# EAGLE design avr_programming_shield_built (EAGLE 6.3)
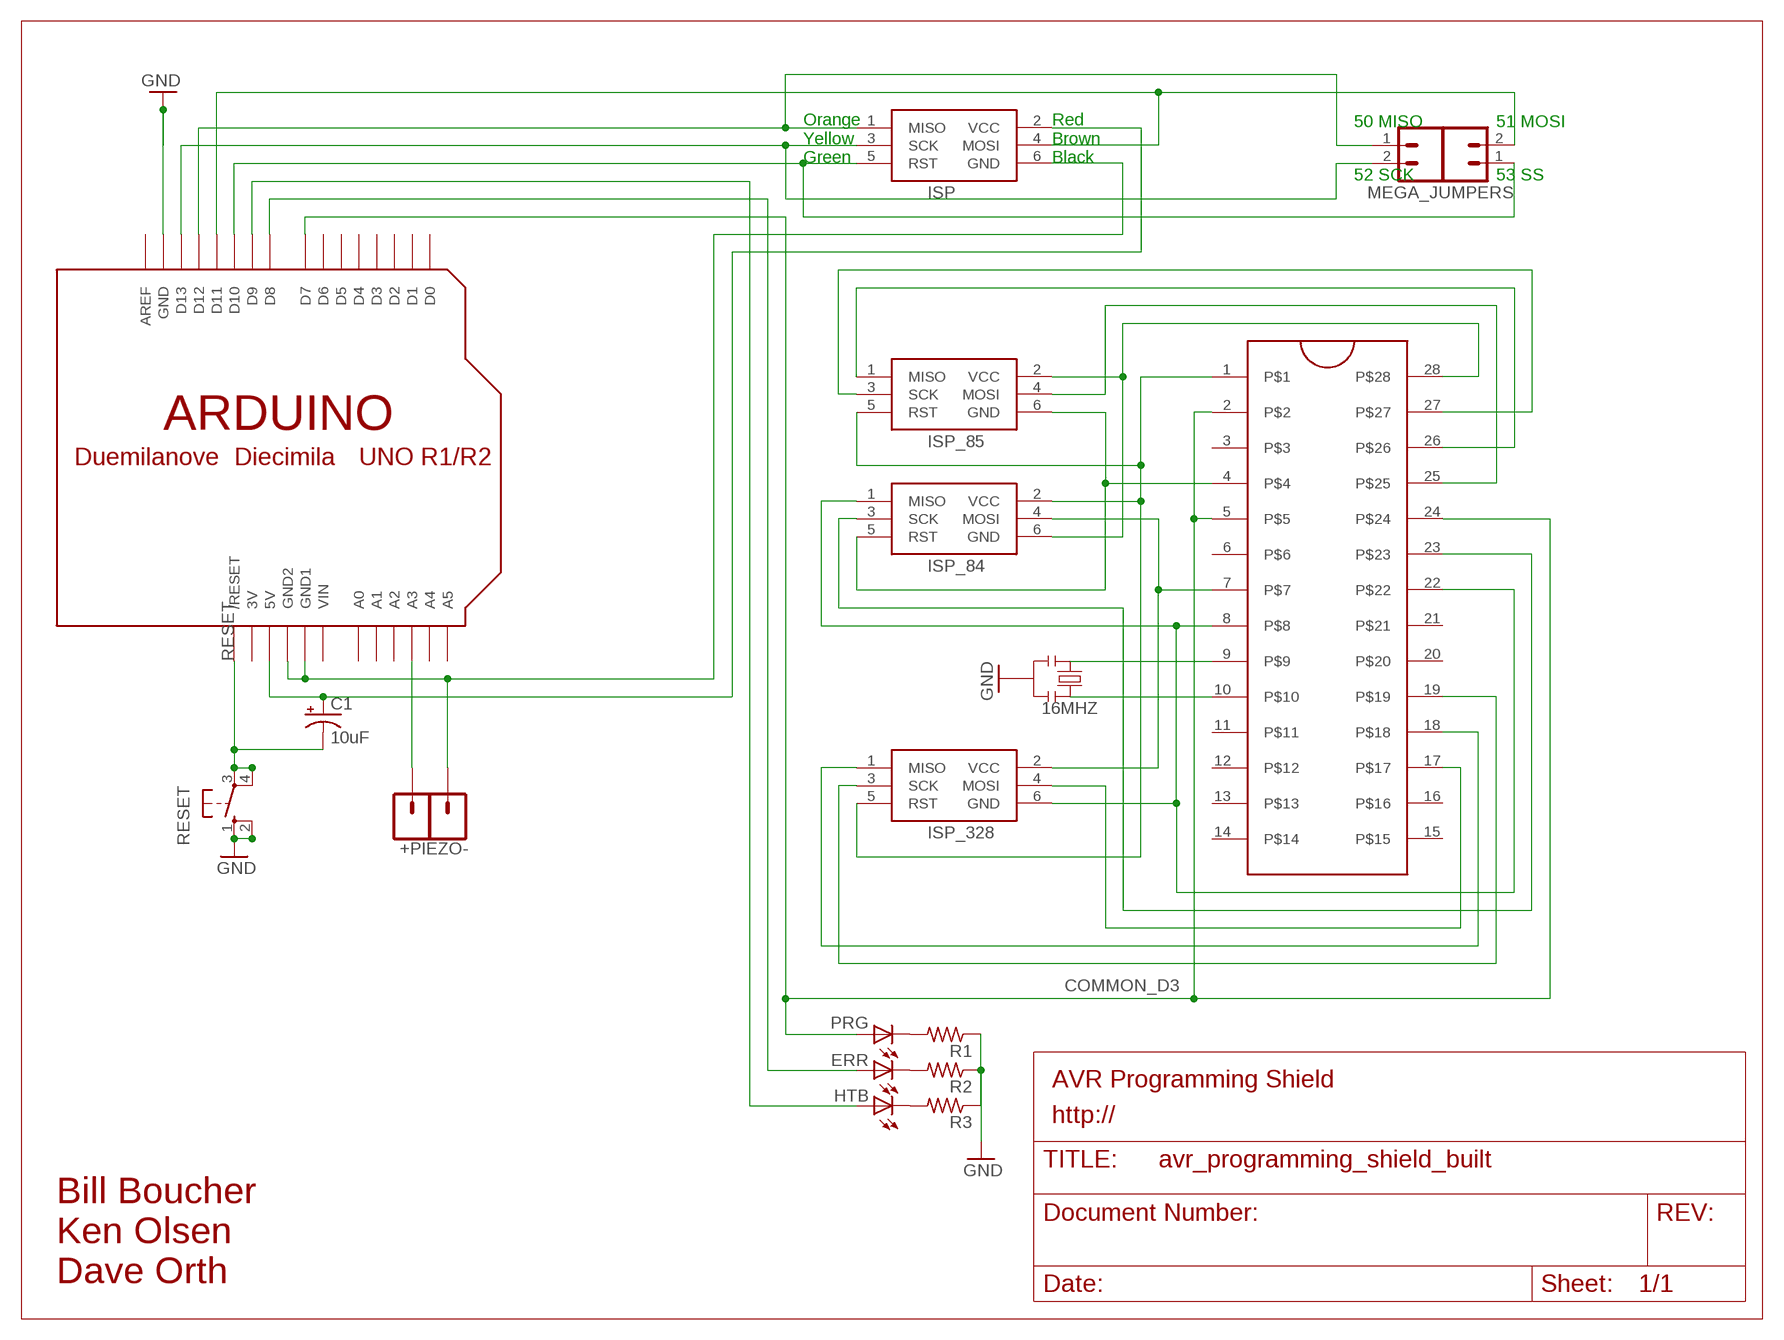
[diagram p0: schematic, sheet 1]

## Parts
16MHZ  RESONATORPTH  [RESONATOR-PTH]
+PIEZO-  M01PTH  [1X01]
C1  10uF  CAP_POLPTH2  [CPOL-RADIAL-10UF-25V]
ERR  LED3MM  [LED3MM]
HTB  LED3MM  [LED3MM]
ISP  AVRISP-6  [AVRISP]
ISP_84  AVRISP-6  [AVRISP]
ISP_85  AVRISP-6  [AVRISP]
ISP_328  AVRISP-6  [AVRISP]
JP2  M02PTH  [1X02]
JP4  M01PTH  [1X01]
MEGA_JUMPERS  M02PTH  [1X02]
PRG  LED3MM  [LED3MM]
R1  R-US_0204/2V  [0204V]
R2  R-US_0204/2V  [0204V]
R3  R-US_0204/2V  [0204V]
RESET  10-XX  [B3F-10XX]
U$1  ARDUINO-NOHOLE  [ARDUINO-NOHOLE]
U$4  ZIFSOCKET-28-3ZIFFSOCKET-28-3  [DIL28-3-ZIF_SOCKET]

## Nets
COMMON_D3: PRG.A U$1.D7 U$4.2 U$4.5 U$4.24
GND [power]: 16MHZ.2 +PIEZO-.1 ISP.6(GND) R1.1 R2.1 R3.1 RESET.1(S) RESET.2(S1) U$1.GND U$1.GND1 U$1.GND2
N$1: ISP_328.4(MOSI) U$4.17
N$2: ISP.3(SCK) MEGA_JUMPERS.2 U$1.D13
N$3: ISP.1(MISO) MEGA_JUMPERS.1 U$1.D12
N$4: ISP_328.1(MISO) U$4.18
N$5: ISP.5(RST) JP2.1 U$1.D10
N$6: ISP.4(MOSI) JP2.2 U$1.D11
N$7: ISP_328.3(SCK) U$4.19
N$8: PRG.K(C) R1.2
N$9: ERR.K(C) R2.2
N$10: HTB.K(C) R3.2
N$11: ISP_84.4(MOSI) ISP_328.2(VCC) U$4.7
N$12: JP4.1 U$1.A3
N$13: ISP_84.2(VCC) ISP_85.5(RST) ISP_328.5(RST) U$4.1
N$15: ISP_84.3(SCK) U$4.23
N$16: ISP_84.6(GND) ISP_85.2(VCC) U$4.28
N$17: HTB.A U$1.D9
N$18: ISP_84.5(RST) ISP_85.6(GND) U$4.4
N$19: ISP_85.4(MOSI) U$4.25
N$20: ISP_85.1(MISO) U$4.26
N$21: ISP_85.3(SCK) U$4.27
N$22: 16MHZ.1 U$4.9
N$24: ERR.A U$1.D8
N$25: 16MHZ.3 U$4.10
N$26: ISP_84.1(MISO) ISP_328.6(GND) U$4.8 U$4.22
RESET: C1.2(-) RESET.3(P) RESET.4(P1) U$1.RESET(/RESET)
VCC: C1.1(+) ISP.2(VCC) U$1.5V
Unconnected: U$1.A0 U$1.A1 U$1.A2 U$1.A4 U$1.A5 U$1.AREF U$1.D0 U$1.D1 U$1.D2 U$1.D3 U$1.D4 U$1.D5 U$1.D6 U$4.3 U$4.6 U$4.11 U$4.12 U$4.13 U$4.14 U$4.15 U$4.16 U$4.20 U$4.21

## Notes on the sheet
- 50 MISO | 51 MOSI
- Orange
  Yellow
  Green
- Red
  Brown
  Black
- 52 SCK | 53 SS
- AVR Programming Shield
- http://
- Bill Boucher
  Ken Olsen
  Dave Orth

## Power pins joined to a net without a drawn wire
3V: U$1.3V
VIN: U$1.VIN

## Library data of the parts
16MHZ = SparkFun_mod:RESONATOR: Resonator Small SMD resonator. This is the itty bitty 10/20MHz resonators with built in caps. CSTCE10M0G55 and CSTCE20M0V53. Footprint has been reviewed closely but hasn't been tested yet.; OC_NEWARK: unknown
+PIEZO- JP4 = SparkFun-Connectors_mod:M01: Header 1 Standard 1-pin 0.1" header. Use with straight break away headers (SKU : PRT-00116), right angle break away headers (PRT-00553), swiss pins (PRT-00743), machine pins (PRT-00117), and female headers (PRT-00115).; OC_NEWARK: unknown
C1 = SparkFun:CAP_POL: Capacitor Polarized These are standard SMD and PTH capacitors. Normally 10uF, 47uF, and 100uF in electrolytic and tantalum varieties. Always verify the external diameter of the through hole cap, it varies with capacity, voltage, and manufacturer. The EIA devices should be standard.; MF: ILLINOIS CAPACITOR,INC.; MPN: 106TTA035M; OC_NEWARK: 30K6594
ERR HTB PRG = adafruit:LED: LED OSRAM: - CHIPLED LG R971, LG N971, LY N971, LG Q971, LY Q971, LO R971, LY R971 LH N974, LH R974 LS Q976, LO Q976, LY Q976 LO Q996 - Hyper CHIPLED LW Q18S LB Q993, LB Q99A, LB R99A - SideLED LS A670, LO A670, LY A670, LG A670, LP A670 LB A673, LV A673, LT A673, LW A673 LH A674 LY A675 LS A676, LA A676, LO A676, LY A676, LW A676 LS A679, LY A679, LG A679 - Hyper Micro SIDELED® LS Y876, LA Y876, LO Y876, LY Y876 LT Y87S - SmartLED LW L88C, LW L88S LB L89C, LB L89S, LG L890 LS L89K, LO L89K, LY L89K LS L896, LA L896, LO L896, LY L896 - TOPLED LS T670, LO T670, LY T670, LG T670, LP T670 LSG T670, LSP T670, LSY T670, LOP T670, LYG T670 LG T671, LOG T671, LSG T671 LB T673, LV T673, LT T673, LW T673 LH T674 LS T676, LA T676, LO T676, LY T676, LB T676, LH T676, LSB T676, LW T676 LB T67C, LV T67C, LT T67C, LS T67K, LO T67K, LY T67K, LW E67C LS E67B, LA E67B, LO E67B, LY E67B, LB E67C, LV E67C, LT E67C LW T67C LS T679, LY T679, LG T679 LS T770, LO T770, LY T770, LG T770, LP T770 LB T773, LV T773, LT T773, LW T773 LH T774 LS E675, LA E675, LY E675, LS T675 LS T776, LA T776, LO T776, LY T776, LB T776 LHGB T686 LT T68C, LB T68C - Hyper Mini TOPLED® LB M676 - Mini TOPLED Santana® LG M470 LS M47K, LO M47K, LY M47K Source: http://www.osram.convergy.de/; OC_NEWARK: unknown
ISP ISP_84 ISP_85 ISP_328 = adafruit:AVRISP: AVR ISP HEADER Standard 6 pin header for AVR programming; OC_NEWARK: unknown
JP2 MEGA_JUMPERS = SparkFun:M02: Header 2 Standard 2-pin 0.1" header. Use with straight break away headers (SKU : PRT-00116), right angle break away headers (PRT-00553), swiss pins (PRT-00743), machine pins (PRT-00117), and female headers (PRT-00115). Molex polarized connector foot print use with SKU : PRT-08233 with associated crimp pins and housings.; OC_NEWARK: unknown
R1-R3 = adafruit:R-US_: RESISTOR, American symbol; OC_NEWARK: unknown
RESET = switch-omron:10-XX: OMRON SWITCH; MPN: B3F-1000; OC_FARNELL: 176432; OC_NEWARK: 36M3542
U$1 = adafruit:ARDUINO: Arduino Diecimila/Duemilanove Make a shield with ease, this package has all the named pins as well as the two mounting drill holes and an outline of the USB and DC power connector. The outline is on the DIMENSION layer, so if your board house uses it they will cut the outline to match. http://www.ladyada.net/library/pcb/eaglelibrary.html; OC_NEWARK: unknown
U$4 = SparkFun_mod:ZIFSOCKET-28-3; OC_NEWARK: unknown

## Net classes
1 power: width 0.61 mm

## Board
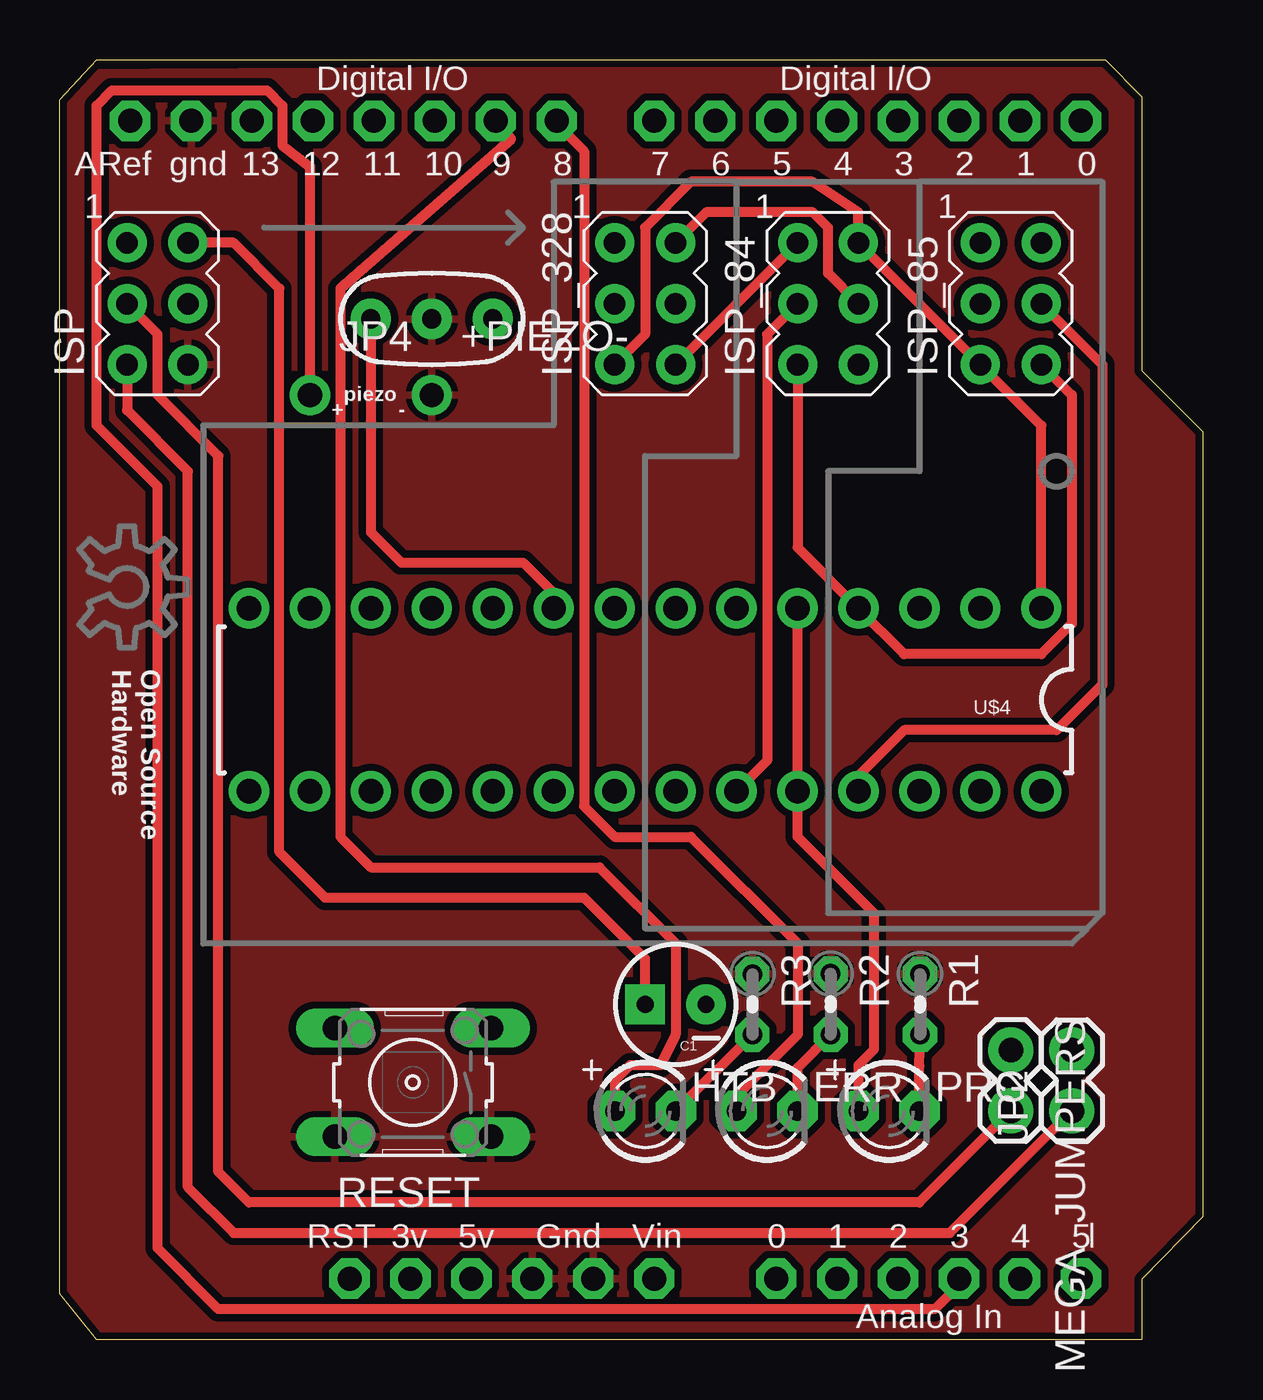
[diagram p1: board, top side]
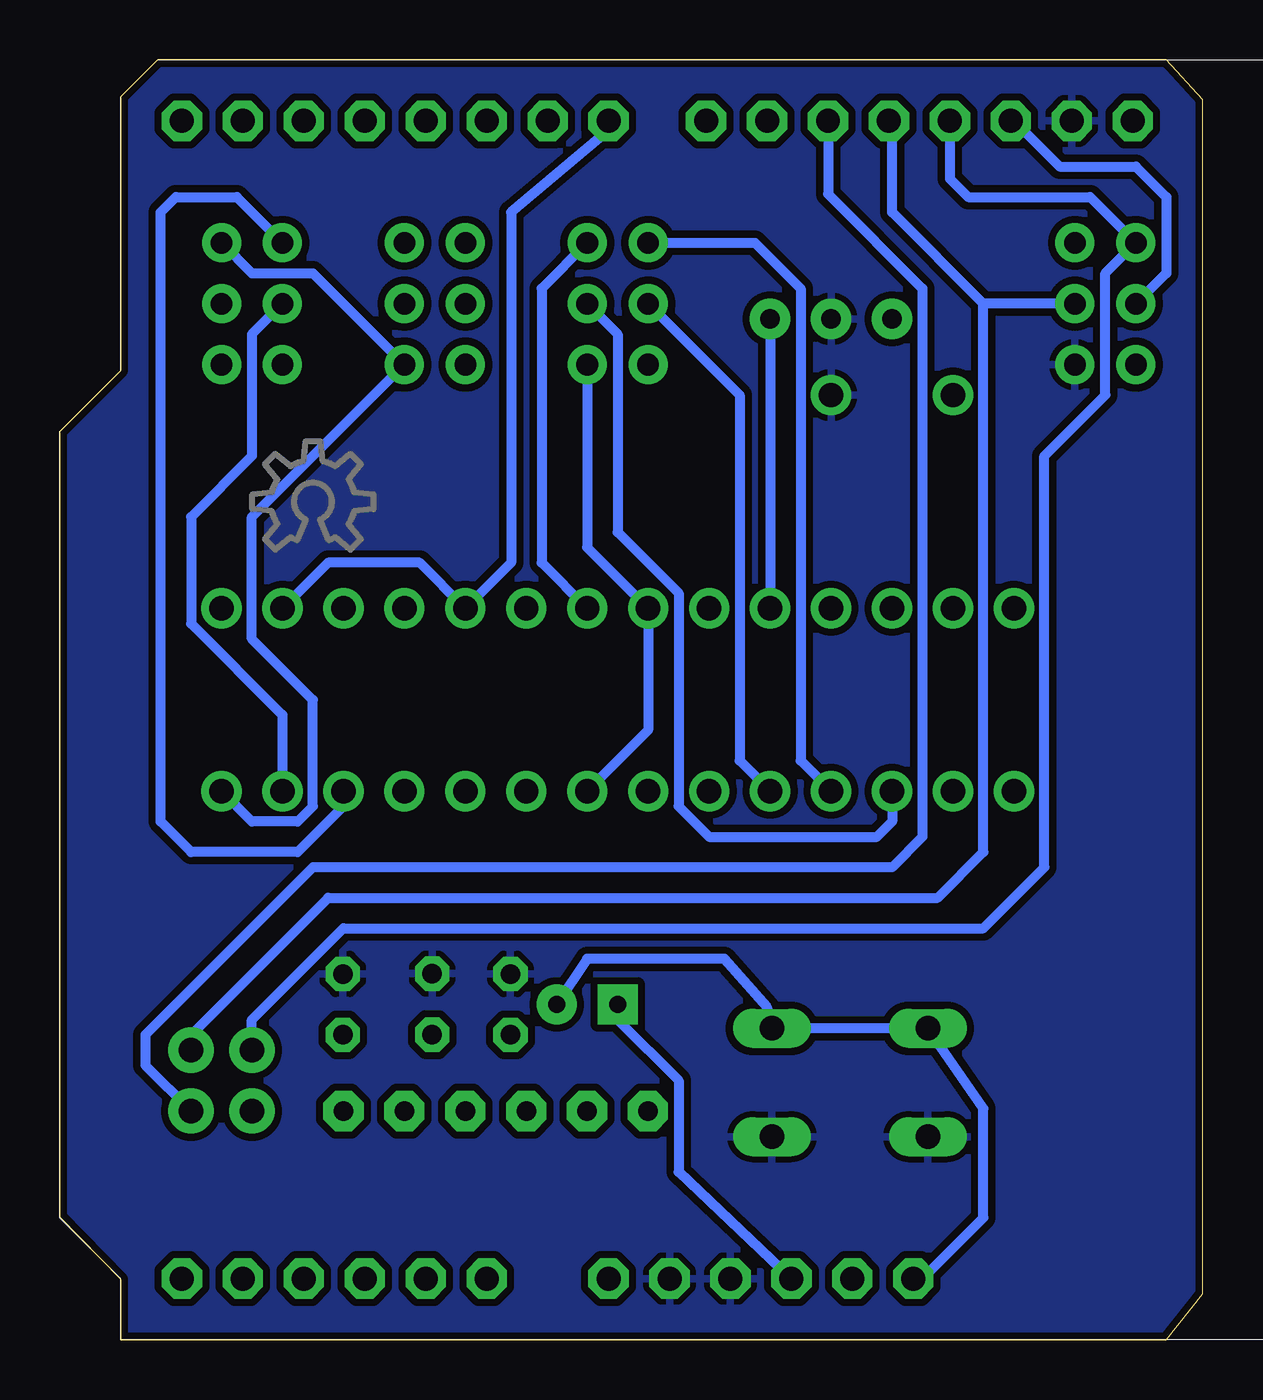
[diagram p2: board, bottom side, seen from below]

Size 47.62 x 53.34 mm. Coordinates in mm from the lower left corner, seen from the top.
Outline: 0,51.69 1.52,53.34 43.56,53.34 45.09,51.82 45.09,40.39 47.62,37.85 47.62,5.11 45.09,2.52 45.09,0 1.52,0 0,1.91 0,51.69
Copper layers (1*16): Top 0.035mm / dielectric 1.5mm / Bottom 0.035mm
Design rules "SparkFun": minimum track width 8mil, minimum drill 20mil, track to track 8mil, track to pad 8mil, pad to pad 8mil, via to via 8mil, smd to smd 8mil, copper to edge 10mil, drill to drill 8mil, minimum pad ring 12mil, minimum via ring 10mil, stop-mask expansion 4mil, vias tented up to drill 25mil, thermal gap 10mil

### Footprints (pad centres in the part's own frame; a part is rotated, then mirrored left to right if it is on the bottom)
RESONATOR-PTH = drill 0.8 pad 1.676: 1 -2.54,0; 2 0,0; 3 2.54,0
1X01 = drill 1.016 pad 1.676: 1 0,0
CPOL-RADIAL-10UF-25V = drill 0.7 pad 1.651 square: 1 1.27,0 | drill 0.7 pad 1.651: 2 -1.27,0
LED3MM = drill 0.813 pad 1.676 octagon: A -1.27,0; K 1.27,0
AVRISP = drill 0.9 pad 1.626: 1 -1.27,2.54; 2 1.27,2.54; 3 -1.27,0; 4 1.27,0; 5 -1.27,-2.54; 6 1.27,-2.54
1X02 = drill 1.016 pad 1.88: 1 0,0; 2 2.54,0
0204V = drill 0.813 octagon: 1 -1.27,0; 2 1.27,0
B3F-10XX = drill 1.016 long: 1 -3.251,2.261; 2 3.251,2.261; 3 -3.251,-2.261; 4 3.251,-2.261
ARDUINO-NOHOLE = drill 1 pad 1.676 octagon: 3V 35.56,2.54; 5V 38.1,2.54; A0 50.8,2.54; A1 53.34,2.54; A2 55.88,2.54; A3 58.42,2.54; A4 60.96,2.54; A5 63.5,2.54; AREF 23.876,50.8; D0 63.5,50.8; D1 60.96,50.8; D2 58.42,50.8; D3 55.88,50.8; D4 53.34,50.8; D5 50.8,50.8; D6 48.26,50.8; D7 45.72,50.8; D8 41.656,50.8; D9 39.116,50.8; D10 36.576,50.8; D11 34.036,50.8; D12 31.496,50.8; D13 28.956,50.8; GND 26.416,50.8; GND1 43.18,2.54; GND2 40.64,2.54; RESET 33.02,2.54; VIN 45.72,2.54
DIL28-3-ZIF_SOCKET = drill 1.016 pad 1.676: 1 -16.51,-3.81; 2 -13.97,-3.81; 3 -11.43,-3.81; 4 -8.89,-3.81; 5 -6.35,-3.81; 6 -3.81,-3.81; 7 -1.27,-3.81; 8 1.27,-3.81; 9 3.81,-3.81; 10 6.35,-3.81; 11 8.89,-3.81; 12 11.43,-3.81; 13 13.97,-3.81; 14 16.51,-3.81; 15 16.51,3.81; 16 13.97,3.81; 17 11.43,3.81; 18 8.89,3.81; 19 6.35,3.81; 20 3.81,3.81; 21 1.27,3.81; 22 -1.27,3.81; 23 -3.81,3.81; 24 -6.35,3.81; 25 -8.89,3.81; 26 -11.43,3.81; 27 -13.97,3.81; 28 -16.51,3.81

### Placement (x,y rotation side)
16MHZ  15.49,42.55 0 top
+PIEZO-  15.49,39.37 0 top
C1  25.65,13.97 180 top
E$1  [OSHWLOGO_TOL_0.2]  2.79,31.37 270 top
ERR  29.46,9.53 0 top
HTB  24.4,9.53 0 top
ISP  4.06,43.18 0 top
ISP_84  32,43.18 0 top
ISP_85  39.62,43.18 0 top
ISP_328  24.38,43.18 0 top
JP2  42.16,9.53 90 top
JP4  10.41,39.37 0 top
MEGA_JUMPERS  39.62,12.06 270 top
PRG  34.54,9.53 0 top
R1  35.84,13.97 270 top
R2  32.12,13.98 270 top
R3  28.85,13.97 270 top
RESET  14.71,10.72 180 top
U$1  -20.95,0 0 top
U$2  [OSHWLOGO_BOTTOM]  37.08,34.92 0 top
U$4  24.38,26.67 180 top

### Tracks (layer width: path | path; a pad name or v marks a point on that pad's centre or on a via)
COMMON_D3
  Top 0.406: PRG.A 33.27,11.43 33.91,12.06 33.91,17.78 30.73,20.95 U$4.24 U$4.5
  Bottom 0.406: U$1.D7 24.77,50.42 28.83,46.99 28.83,32.38 U$4.5 32.64,32.38 36.45,32.38 U$4.2
GND
  pour Bottom (isolate 0.305): -18.41,53.34 48.26,53.98 47.62,-1.14 -19.05,-0.64
  pour Top (isolate 0.305): -18.41,52.7 48.01,53.09 47.75,-0.38 -18.41,-1.02
N$1
  Bottom 0.406: ISP_328.4 24.38,41.91 24.38,33.66 21.84,31.11 21.84,22.23 20.57,20.95 13.59,20.95 12.95,21.59 U$4.17
N$2
  Top 0.406: MEGA_JUMPERS.2 35.81,5.71 7.87,5.71 6.6,6.99 6.6,36.83 4.06,39.37 4.06,41.91 ISP.3
  Bottom 0.406: U$1.D13 7.87,50.8 5.97,48.9 2.79,48.9 1.52,47.62 1.52,44.45 ISP.3
N$3
  Bottom 0.406: U$1.D12 10.54,48.39 9.78,47.62 4.7,47.62 ISP.1 4.06,44.45 4.06,39.37 6.6,36.83 6.6,19.68 9.14,17.14 35.81,17.14 39.62,13.34 MEGA_JUMPERS.1
N$4
  Bottom 0.406: ISP_328.1 18.67,45.72 16.76,43.81 16.76,24.13 U$4.18
N$5
  Top 0.406: ISP.5 2.79,38.73 5.33,36.2 5.33,6.35 7.24,4.45 37.08,4.45 JP2.1
  Bottom 0.406: U$1.D10 15.62,47.75 11.68,43.81 11.68,20.95 12.95,19.68 37.08,19.68 44.07,12.7 44.07,11.43 JP2.1
N$6
  Bottom 0.406: JP2.2 42.16,12.7 36.45,18.41 11.05,18.41 9.14,20.32 9.14,43.18 | 9.14,43.18 12.95,46.99 12.95,50.67 U$1.D11 | ISP.4 9.14,43.18
N$7
  Bottom 0.406: ISP_328.3 19.3,39.37 19.3,24.13 U$4.19
N$8
  Top 0.406: PRG.K 35.81,11.4 R1.2
N$9
  Top 0.406: ERR.K 30.73,11.33 R2.2
N$10
  Top 0.406: R3.2 28.84,12.7 HTB.K
N$11
  Top 0.406: ISP_84.4 32,44.45 32,46.35 31.37,46.99 26.92,46.99 ISP_328.2
  Bottom 0.406: ISP_328.2 27.56,43.81 27.56,32.38 U$4.7
N$12
  Top 0.406: U$1.A3 37.47,2.29 36.45,1.27 6.6,1.27 4.06,3.81 4.06,35.56 1.52,38.1 1.52,51.44 2.16,52.07 8.64,52.07 9.27,51.44 9.27,49.78 10.41,48.9 JP4.1
N$13
  Top 0.406: ISP_328.5 24.38,41.91 24.38,46.35 26.29,48.26 31.37,48.26 33.27,46.99 ISP_84.2 ISP_85.5 40.89,38.1 U$4.1
N$15
  Top 0.406: ISP_84.3 29.46,41.91 29.46,24.13 U$4.23
N$16
  Bottom 0.406: ISP_85.2 39.62,44.45 37.08,44.45 ISP_84.6 39.62,34.29 39.62,29.21 37.08,26.67 37.08,22.23 37.72,21.59 39.62,21.59 U$4.28
N$17
  Top 0.406: U$1.D9 18.8,50.04 11.68,43.81 11.68,20.95 12.95,19.68 22.48,19.68 25.65,16.51 25.65,12.7 25.02,11.43 23.75,11.43 23.11,10.79 HTB.A 23.11,9.51 HTB.A
N$18
  Top 0.406: ISP_85.6 42.16,39.37 42.16,29.84 40.89,28.57 35.18,28.57 U$4.4 30.73,33.02 ISP_84.5
N$19
  Top 0.406: ISP_85.4 43.43,40.64 43.43,27.3 41.53,25.4 35.18,25.4 33.27,23.5 U$4.25
N$20
  Bottom 0.406: ISP_85.1 40.26,47.62 42.8,47.62 43.43,46.99 43.43,21.59 42.16,20.32 37.72,20.32 35.81,22.23 U$4.26
N$21
  Bottom 0.406: ISP_85.3 39.62,41.91 39.62,36.83 42.16,34.29 42.16,29.84 38.35,26.04 U$4.27
N$22
  Top 0.406: 16MHZ.1 12.95,33.66 14.22,32.38 19.3,32.38 20.57,31.11 U$4.9
N$24
  Top 0.406: U$1.D8 20.7,50.67 21.84,49.53 21.84,22.23 23.11,20.95 26.29,20.95 30.73,16.51 30.73,12.7 28.19,10.16 ERR.A
N$25
  Bottom 0.406: 16MHZ.3 U$4.10
N$26
  Top 0.406: ISP_328.6 ISP_84.1
  Bottom 0.406: ISP_328.6 25.65,33.02 U$4.8 23.11,25.4 U$4.22
RESET
  Bottom 0.406: U$1.RESET 11.68,2.54 9.14,5.08 9.14,9.63 RESET.4 RESET.3 18.16,13.84 19.94,15.88 25.65,15.88 C1.2
VCC
  Top 0.406: C1.1 24.38,15.88 21.84,18.41 11.05,18.41 9.14,20.32 9.14,43.81 7.24,45.72 ISP.2
  Bottom 0.406: C1.1 24.38,13.34 21.84,10.79 21.84,6.99 U$1.5V

### Text on the board
tPlace: piezo | + | - | Open Source / Hardware
tDocu: Jumper ISP | to target chip | ISP | 168/328 | 44/84 | 45/85 | 1 | Burn bootloader | Tools -> Boards | Insert target chip | Place ISP jumper | Upload ArduinoISP | Mega / jumpers | D3 | 50 | 51 | 52 | 53 | Reset | Heart | Error | Prog
bDocu: Open Source / Hardware | Avr Programming Shield / Jan 2013